# EAGLE design IsoBunny (EAGLE 9.2.1)
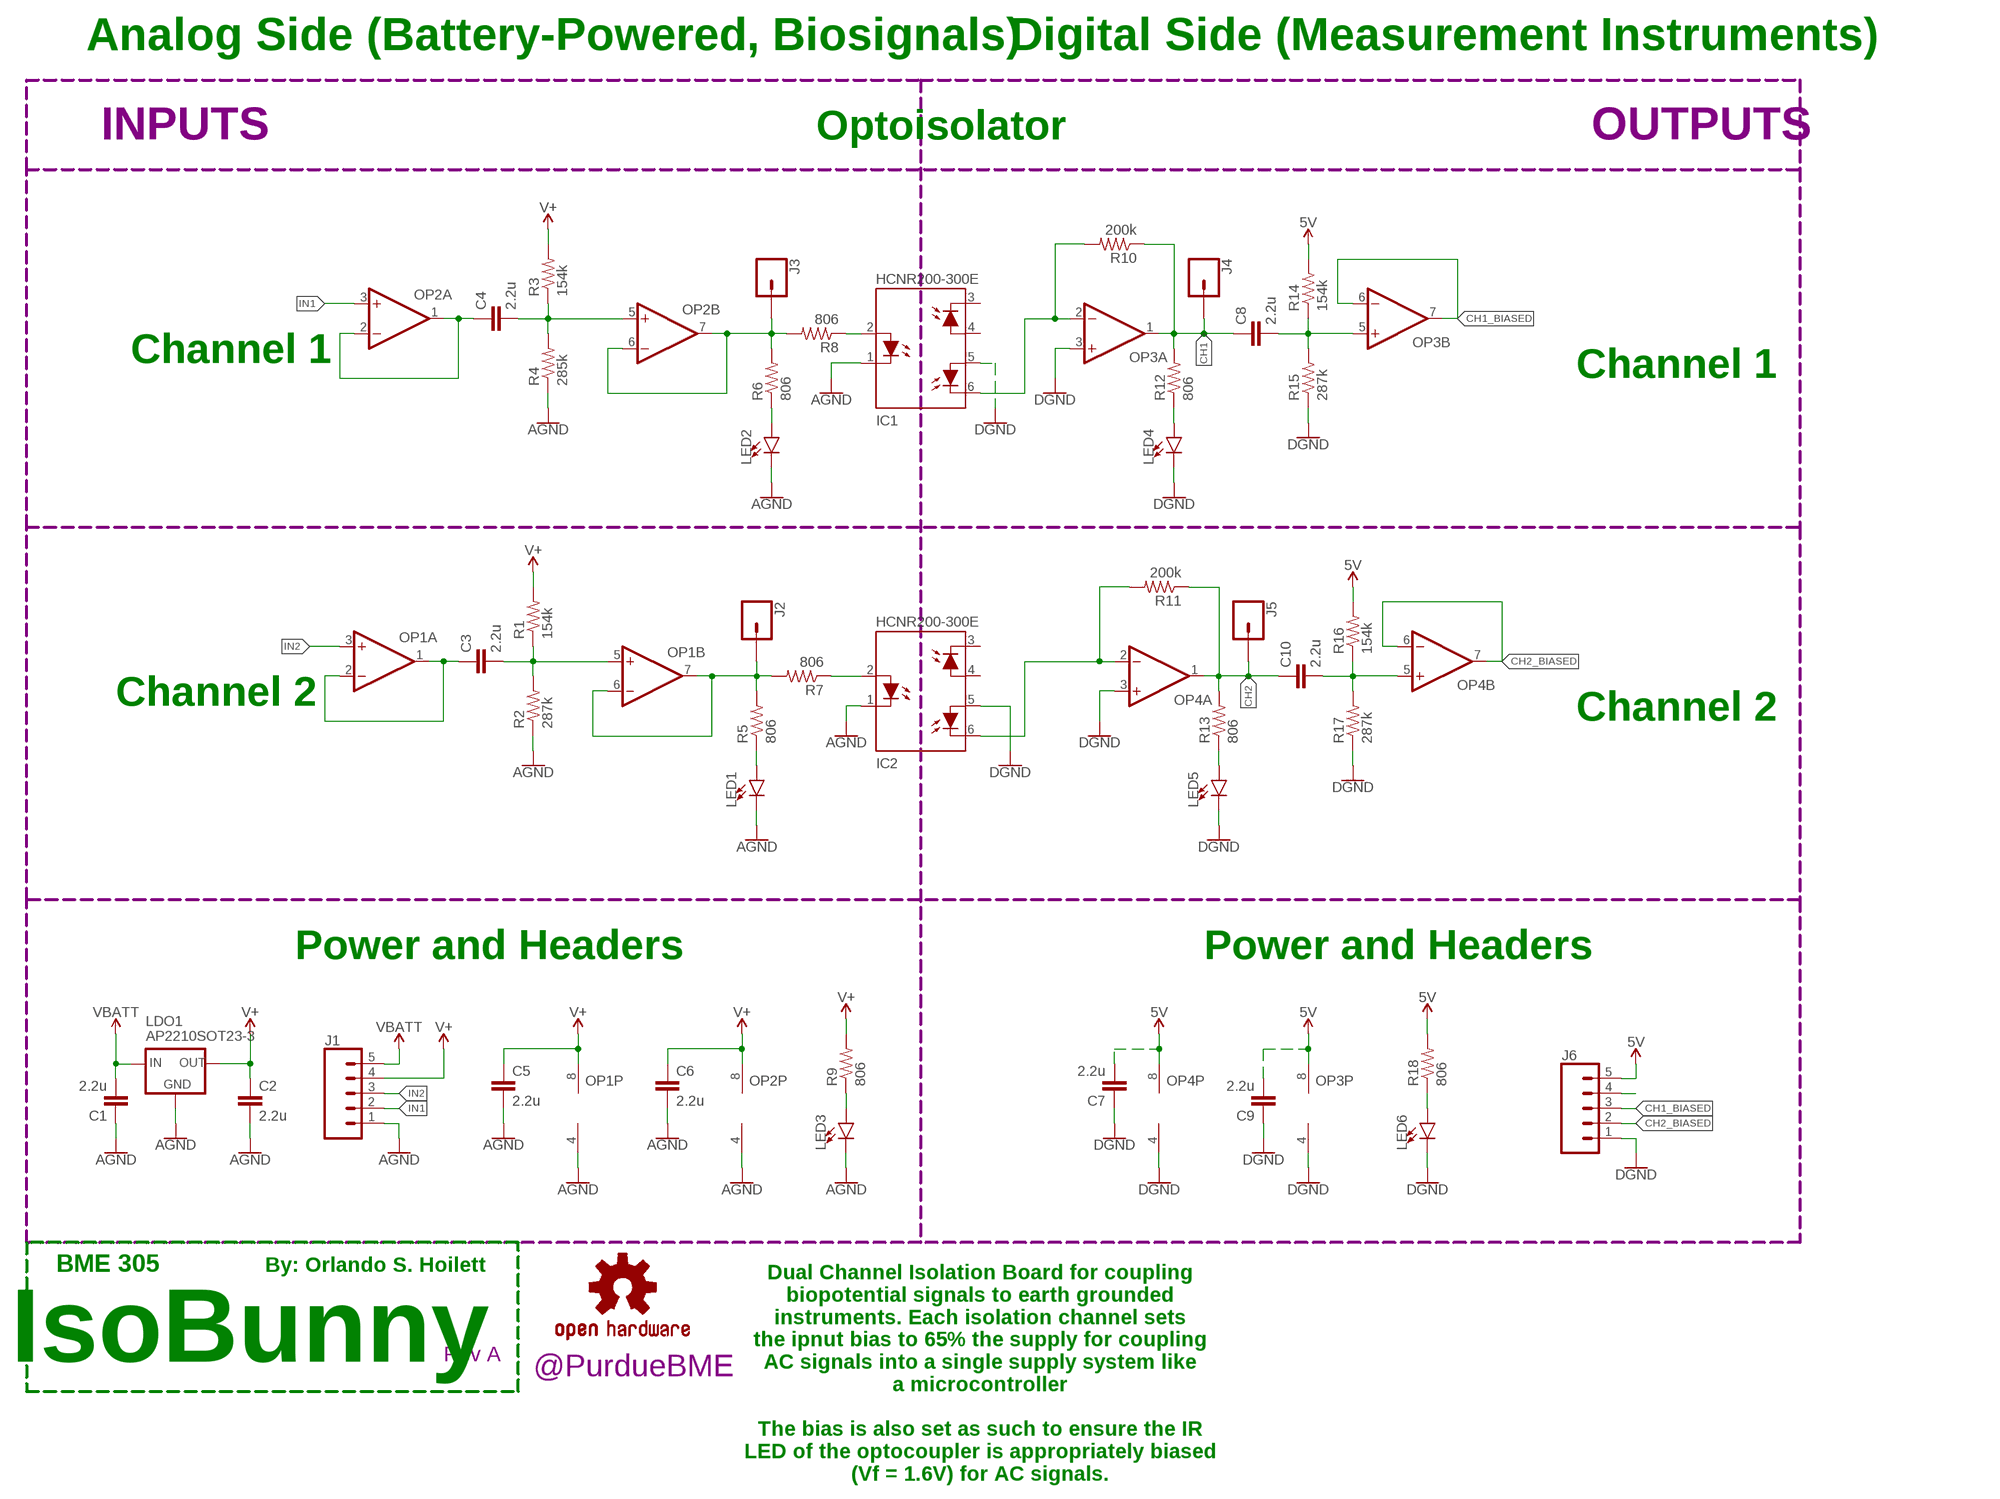
[diagram p0: schematic, sheet 1]

## Parts
C1  2.2u  CAPACITOR0603  [C0603]
C2  2.2u  CAPACITOR0603  [C0603]
C3  2.2u  CAPACITOR0603  [C0603]
C4  2.2u  CAPACITOR0603  [C0603]
C5  2.2u  CAPACITOR0603  [C0603]
C6  2.2u  CAPACITOR0603  [C0603]
C7  2.2u  CAPACITOR0603  [C0603]
C8  2.2u  CAPACITOR0603  [C0603]
C9  2.2u  CAPACITOR0603  [C0603]
C10  2.2u  CAPACITOR0603  [C0603]
IC1  HCNR200-300E  [DIP8-400]
IC2  HCNR200-300E  [DIP8-400]
J1  CONN_05  [1X05]
J2  CONN_01PTH_NO_SILK_KIT  [1X01NS_KIT]
J3  CONN_01PTH_NO_SILK_KIT  [1X01NS_KIT]
J4  CONN_01PTH_NO_SILK_KIT  [1X01NS_KIT]
J5  CONN_01PTH_NO_SILK_KIT  [1X01NS_KIT]
J6  CONN_05  [1X05]
LDO1  AP2210SOT23-3  [SOT23]
LED1  LED5MM  [LED_5MM]
LED2  LED5MM  [LED_5MM]
LED3  LED5MM  [LED_5MM]
LED4  LED5MM  [LED_5MM]
LED5  LED5MM  [LED_5MM]
LED6  LED5MM  [LED_5MM]
LOGO1  OSHW-LOGOL  [OSHW-LOGO-L]
OP1  OP-DUALR  [SO8]
OP2  OP-DUALR  [SO8]
OP3  OP-DUALR  [SO8]
OP4  OP-DUALR  [SO8]
R1  154k  RESISTOR0603  [R0603]
R2  287k  RESISTOR0603  [R0603]
R3  154k  RESISTOR0603  [R0603]
R4  285k  RESISTOR0603  [R0603]
R5  806  RESISTOR0603  [R0603]
R6  806  RESISTOR0603  [R0603]
R7  806  RESISTOR0603  [R0603]
R8  806  RESISTOR0603  [R0603]
R9  806  RESISTOR0603  [R0603]
R10  200k  RESISTOR0603  [R0603]
R11  200k  RESISTOR0603  [R0603]
R12  806  RESISTOR0603  [R0603]
R13  806  RESISTOR0603  [R0603]
R14  154k  RESISTOR0603  [R0603]
R15  287k  RESISTOR0603  [R0603]
R16  154k  RESISTOR0603  [R0603]
R17  287k  RESISTOR0603  [R0603]
R18  806  RESISTOR0603  [R0603]
REV1  REVISION.A  [REV.A]
U$1  PURDUE_BME_HANDLE  [PURDUE_BME_HANDLE.1]

## Nets
5V: C7.2 C9.2 J6.5 OP3.8(P:V+) OP4.8(P:V+) R14.2 R16.2 R18.2
AGND: C1.1 C2.2 C5.2 C6.2 IC1.1(C) IC2.1(C) J1.1 LDO1.1(GND) LED1.K(C) LED2.K(C) LED3.K(C) OP1.4(P:V-) OP2.4(P:V-) R2.1 R4.1
CH1: C8.1 J4.1 OP3.1(A:OUT) R10.1 R12.2
CH1_BIASED: J6.3 OP3.6(B:-IN) OP3.7(B:OUT)
CH2: C10.1 J5.1 OP4.1(A:OUT) R11.1 R13.2
CH2_BIASED: J6.2 OP4.6(B:-IN) OP4.7(B:OUT)
DGND: C7.1 C9.1 IC1.5(A2) IC2.5(A2) J6.1 LED4.K(C) LED5.K(C) LED6.K(C) OP3.3(A:+IN) OP3.4(P:V-) OP4.3(A:+IN) OP4.4(P:V-) R15.1 R17.1
IN1: J1.2 OP2.3(A:+IN)
IN2: J1.3 OP1.3(A:+IN)
N$1: C4.1 OP2.1(A:OUT) OP2.2(A:-IN)
N$2: LED3.A R9.1
N$3: C4.2 OP2.5(B:+IN) R3.1 R4.2
N$4: C3.1 OP1.1(A:OUT) OP1.2(A:-IN)
N$5: IC1.6(C2) OP3.2(A:-IN) R10.2
N$6: C3.2 OP1.5(B:+IN) R1.1 R2.2
N$7: IC2.6(C2) OP4.2(A:-IN) R11.2
N$9: LED6.A R18.1
N$10: IC2.2(A) R7.1
N$11: C10.2 OP4.5(B:+IN) R16.1 R17.2
N$13: LED2.A R6.1
N$14: IC1.2(A) R8.1
N$15: C8.2 OP3.5(B:+IN) R14.1 R15.2
N$16: LED4.A R12.1
N$17: LED1.A R5.1
N$18: J6.4
N$19: LED5.A R13.1
OUT1: J3.1 OP2.6(B:-IN) OP2.7(B:OUT) R6.2 R8.2
OUT2: J2.1 OP1.6(B:-IN) OP1.7(B:OUT) R5.2 R7.2
V+: C2.1 C5.1 C6.1 J1.4 LDO1.2(OUT) OP1.8(P:V+) OP2.8(P:V+) R1.2 R3.2 R9.2
V_BATT: C1.2 J1.5 LDO1.3(IN) ; supply symbol labelled VBATT
Unconnected: IC1.3(C1) IC1.4(A1) IC2.3(C1) IC2.4(A1)

## Notes on the sheet
- Analog Side (Battery-Powered, Biosignals) | Digital Side (Measurement Instruments)
- INPUTS | Optoisolator | OUTPUTS
- Channel 1
- Channel 1
- Channel 2
- Channel 2
- Power and Headers | Power and Headers
- BME 305 | By: Orlando S. Hoilett
- IsoBunny
- Dual Channel Isolation Board for coupling
  biopotential signals to earth grounded
  instruments. Each isolation channel sets
  the ipnut bias to 65% the supply for coupling
  AC signals into a single supply system like
  a microcontroller
  
  The bias is also set as such to ensure the IR
  LED of the optocoupler is appropriately biased
  (Vf = 1.6V) for AC signals.

## Library data of the parts
C1-C10 = CalvEngIO-Passives:CAPACITOR
IC1 IC2 = avago:HCNR20*: High-Linearity Analog Optocouplers Source: AV02-0886EN+DS+HCNR200+10Dec2011.pdf
J1 J6 = CalvEngIO-Connectors:CONN_05: Multi connection point. Often used as Generic Header-pin footprint for 0.1 inch spaced/style header connections On any of the 0.1 inch spaced packages, you can populate with these: Break Away Headers - Straight <https://www.sparkfun.com/products/116> (PRT-00116) Break Away Male Headers - Right Angle <https://www.sparkfun.com/products/553> (PRT-00553) Female Headers <https://www.sparkfun.com/products/115> (PRT-00115) Break Away Headers - Machine Pin <https://www.sparkfun.com/products/117> (PRT-00117) Break Away Female Headers - Swiss Machine Pin <https://www.sparkfun.com/products/743> (PRT-00743) For SCREWTERMINALS and SPRING TERMINALS visit here: Screw Terimnals on SparkFun.com <https://www.sparkfun.com/search/results?term=Screw+Terminals> (5mm/3.5mm/2.54mm spacing) This device is also useful as a general connection point to wire up your design to another part of your project. Our various solder wires solder well into these plated through hole pads. Hook-Up Wire - Assortment (Stranded, 22 AWG) <https://www.sparkfun.com/products/11375> (PRT-11375) Hook-Up Wire - Assortment (Solid Core, 22 AWG) <https://www.sparkfun.com/products/11367> (PRT-11367) View the entire wire category on our website here <https://www.sparkfun.com/categories/141> Special notes: Molex polarized connector foot print use with SKU : PRT-08231 with associated crimp pins and housings. 1MM SMD Version SKU: PRT-10208
J2-J5 = CalvEngIO-Connectors:CONN_01: Single connection point. Often used as Generic Header-pin footprint for 0.1 inch spaced/style header connections On any of the 0.1 inch spaced packages, you can populate with these: Break Away Headers - Straight <https://www.sparkfun.com/products/116> (PRT-00116) Break Away Male Headers - Right Angle <https://www.sparkfun.com/products/553> (PRT-00553) Female Headers <https://www.sparkfun.com/products/115> (PRT-00115) Break Away Headers - Machine Pin <https://www.sparkfun.com/products/117> (PRT-00117) Break Away Female Headers - Swiss Machine Pin <https://www.sparkfun.com/products/743> (PRT-00743) This device is also useful as a general connection point to wire up your design to another part of your project. Our various solder wires solder well into these plated through hole pads. Hook-Up Wire - Assortment (Stranded, 22 AWG) <https://www.sparkfun.com/products/11375> (PRT-11375) Hook-Up Wire - Assortment (Solid Core, 22 AWG) <https://www.sparkfun.com/products/11367> (PRT-11367) View the entire wire category on our website here <https://www.sparkfun.com/categories/141> Special notes: SMTSO-256-ET is a "flush mount" nut for a 4-40 screw. We mostly use this on specialty testbeds; it is a nice way to connect hardware to your PCB at an adjustable hieght. Also note, the SNAP packages are for using a snappable style connector. We sell a baggie of snaps and they are also used on two LilyPad designs: Snap Assortment - 30 pack (male and female) <https://www.sparkfun.com/products/11347> (DEV-11347) LilyPad Arduino SimpleSnap <https://www.sparkfun.com/products/10941> (DEV-10941) LilyPad SimpleSnap Protoboard <https://www.sparkfun.com/products/10940> (DEV-10940)
LDO1 = CalvEngIO-Power:AP2210
LED1-LED6 = CalvEngIO-LED:LED: LED (Generic) Standard schematic elements and footprints for 5mm, 3mm, 1206, and 0603 sized LEDs. Generic LEDs with no color specified. LTST-C190KGKT: arrow indicates cathode
LOGO1 = CalvEngIO-Logos:OSHW-LOGO: Open-Source Hardware (OSHW) Logo This logo indicates the piece of hardware it is found on incorporates a OSHW license and/or adheres to the definition of open source hardware found here: http://freedomdefined.org/OSHW
OP1-OP4 = CalvEngIO-AnalogIC:OP-DUAL: Precision Micropower, Low Noise CMOS, Rail-to-Rail Input/Output Operational Amplifiers Source: http://www.analog.com/static/imported-files/data_sheets/AD8603_8607_8609.pdf; MPN: AD8607ARMZ-R2; OC_FARNELL: 1651293; OC_NEWARK: 19M8927
R1-R18 = CalvEngIO-Passives:RESISTOR
REV1 = CalvEngIO-Symbols:REVISION.A
U$1 = CalvEngIO-Logos:PURDUE_BME_HANDLE

## Board
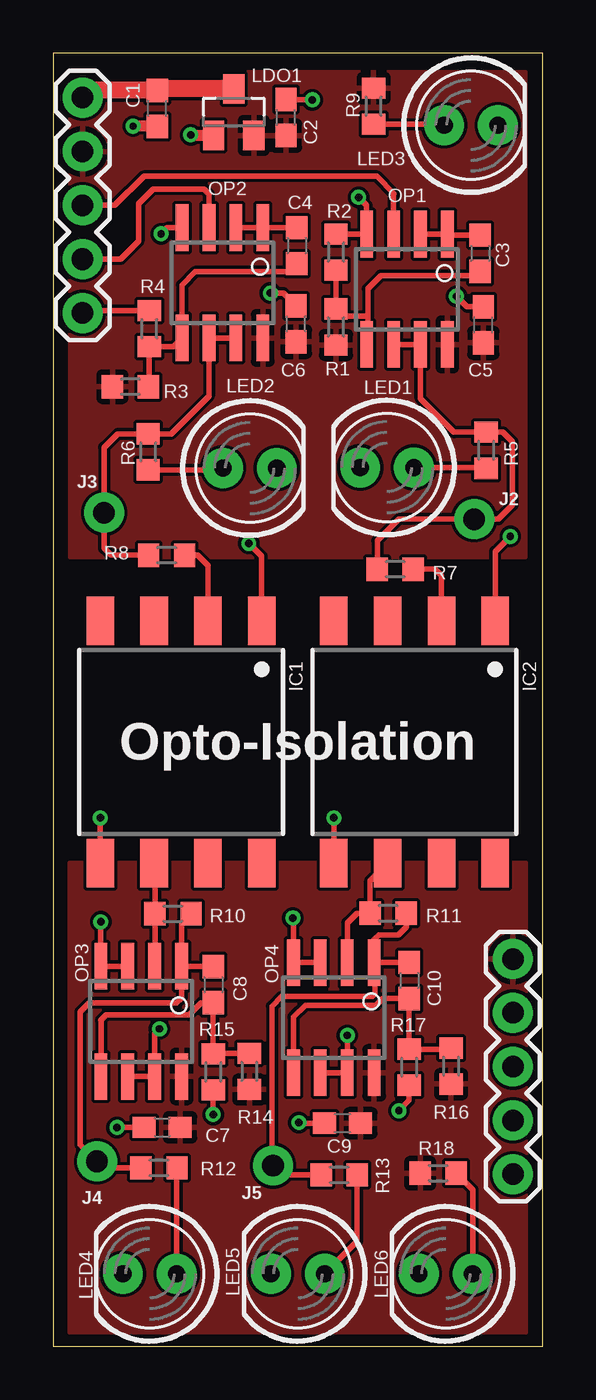
[diagram p1: board, top side]
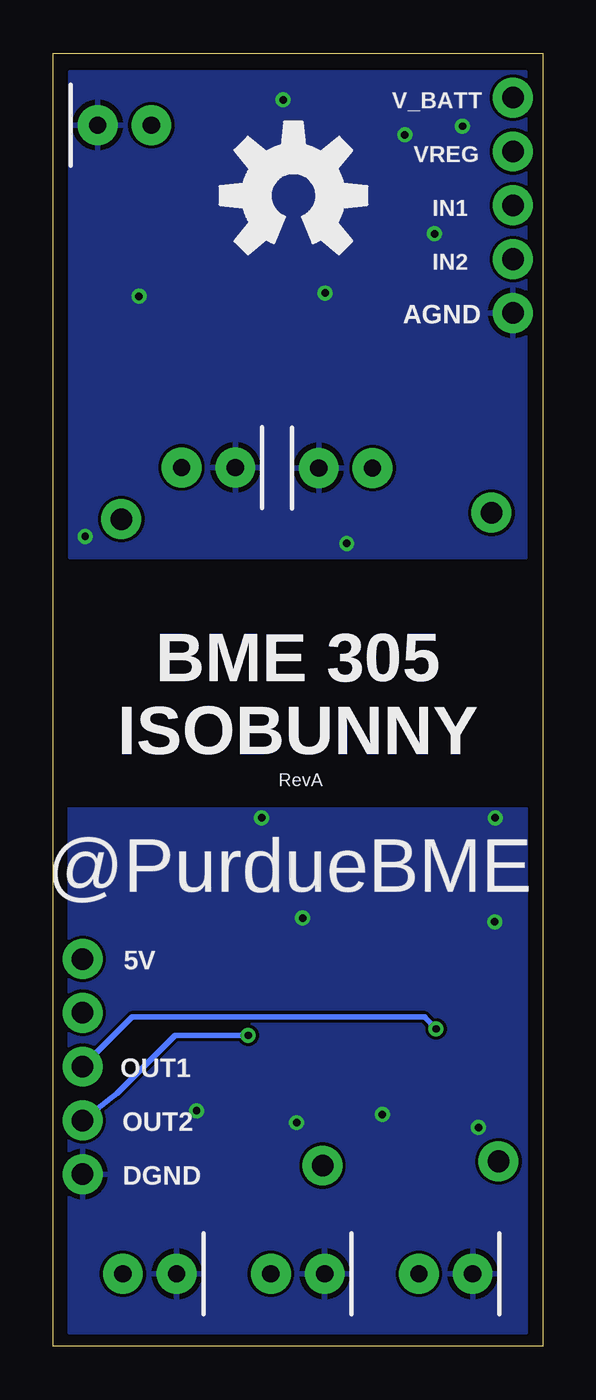
[diagram p2: board, bottom side, seen from below]

Size 23.11 x 61.04 mm. Coordinates in mm from the lower left corner, seen from the top.
Outline: 0,0 23.11,0 23.11,61.04 0,61.04 0,0
Copper layers (1*16): Top 0.0356mm / dielectric 1.5011mm / Bottom 0.0356mm
Design rules "LaenPCBOrder": minimum track width 6mil, minimum drill 13mil, track to track 6mil, track to pad 6mil, pad to pad 6mil, via to via 6mil, smd to smd 6mil, copper to edge 15mil, drill to drill 6mil, minimum pad ring 7mil, minimum via ring 7mil, stop-mask expansion 3mil, vias tented up to drill 0mil, thermal gap 10mil

### Footprints (pad centres in the part's own frame; a part is rotated, then mirrored left to right if it is on the bottom)
C0603 = smd 1.1 x 1: 1 -0.85,0; 2 0.85,0
DIP8-400 = smd 1.3 x 2.29: 1 -3.81,-5.72; 2 -1.27,-5.72; 3 1.27,-5.72; 4 3.81,-5.72; 5 3.81,5.72; 6 1.27,5.72; 7 -1.27,5.72; 8 -3.81,5.72
1X05 = drill 1.016 pad 1.88: 1 0,0; 2 2.54,0; 3 5.08,0; 4 7.62,0; 5 10.16,0
1X01NS_KIT = drill 1.016 pad 1.88: 1 0,0
SOT23 = smd 1 x 1.4: 1 -0.95,-1.1; 2 0.95,-1.1; 3 0,1.1
LED_5MM = drill 0.813 pad 1.88: A -1.27,0; K 1.27,0
SO8 = smd 0.6 x 2.2: 1 -1.905,-2.6; 2 -0.635,-2.6; 3 0.635,-2.6; 4 1.905,-2.6; 5 1.905,2.6; 6 0.635,2.6; 7 -0.635,2.6; 8 -1.905,2.6
R0603 = smd 1 x 1.1: 1 -0.85,0; 2 0.85,0

### Placement (x,y rotation side)
C1  4.93,58.42 90 top
C2  11,57.99 90 top
C3  20.17,51.59 270 top
C4  11.51,51.94 270 top
C5  20.32,48.21 90 top
C6  11.48,48.26 90 top
C7  5.16,10.34 0 top
C8  7.57,17.07 270 top
C9  13.67,10.54 0 top
C10  16.81,17.27 270 top
IC1  6.05,28.52 180 top
IC2  17.07,28.52 180 top
J1  1.4,48.77 90 top
J2  19.89,39.04 0 top
J3  2.41,39.34 0 top
J4  2.08,8.74 0 top
J5  10.39,8.53 0 top
J6  21.72,8.13 90 top
LDO1  8.53,58.24 0 top
LED1  15.77,41.48 180 top
LED2  9.3,41.45 0 top
LED3  19.74,57.63 0 top
LED4  4.57,3.43 180 top
LED5  11.56,3.43 180 top
LED6  18.54,3.43 180 top
LOGO1  11.76,54.31 0 bottom
OP1  16.71,49.89 180 top
OP2  8,50.19 180 top
OP3  4.17,15.34 180 top
OP4  13.26,15.52 180 top
R1  13.36,48.11 270 top
R2  13.36,51.64 270 top
R3  3.66,45.29 180 top
R4  4.55,48.03 270 top
R5  20.45,42.29 90 top
R6  4.5,42.21 90 top
R7  16.15,36.68 180 top
R8  5.36,37.34 180 top
R9  15.14,58.52 90 top
R10  5.66,20.42 180 top
R11  15.82,20.45 180 top
R12  5,8.43 180 top
R13  13.51,8.1 180 top
R14  9.27,12.98 270 top
R15  7.57,12.95 90 top
R16  18.8,13.23 270 top
R17  16.81,13.18 90 top
R18  18.19,8.18 180 top
REV1  12.47,26.42 0 bottom
U$1  11.94,23.98 180 bottom

### Tracks (layer width: path | path; a pad name or v marks a point on that pad's centre or on a via)
5V
  pour Top: 22.35,22.86 22.35,0.64 0.76,0.64 0.76,22.86
AGND  (via drill 0.35)
  Top 0.254: 5.93,52.79 OP2.4 5.39,52.79 v5.1,52.5 | C5.2 19.55,49.06 v19.05,49.55 | v14.43,54.23 14.81,53.85 OP1.4 R2.1 | IC2.1 20.88,37.51 v21.59,38.23 | IC1.1 9.86,37.29 v9.25,37.9 | C2.2 11.01,58.83 v12.24,58.83 | C6.2 10.88,49.71 v10.26,49.71 | R4.1 1.51,48.88 J1.1
  Top 0.508: LDO1.1 6.54,57.14 v6.5,57.17 | C1.1 v3.8,57.57 v3.79,57.58
  pour Bottom: 0.76,60.15 22.35,60.15 22.35,37.24 0.76,37.24
CH1
  Top 0.254: OP3.1 6.07,19.98 R10.1 | OP3.1 7.55,17.94 C8.1 | OP3.1 6.07,16.43 5.84,16.2 1.7,16.2 1.29,15.8 1.29,9.53 J4.1 2.39,8.43 R12.2
CH1_BIASED  (via drill 0.35)
  Top 0.254: OP3.6 OP3.7 4.8,14.76 v5.03,14.99
  Bottom 0.254: v5.03,14.99 5.56,15.52 5.56,15.54 19.38,15.54 J6.3
CH2
  Top 0.254: 15.21,18.12 OP4.1 15.16,19.2 15.39,19.43 16.31,19.43 16.67,19.8 R11.1 | 15.21,18.12 C10.1 | 15.21,18.12 15.19,18.09 15.19,16.61 15.09,16.51 10.79,16.51 10.34,16.05 10.34,8.59 J5.1 10.82,8.1 R13.2
CH2_BIASED  (via drill 0.35)
  Top 0.254: OP4.6 OP4.7 v13.89,14.68
  Bottom 0.254: v13.89,14.68 17.35,14.68 20.09,11.94 20.37,11.72 J6.2
DGND  (via drill 0.35)
  Top 0.254: v2.26,20.04 OP3.4 OP3.3 | OP4.3 OP4.4 11.35,20.19 v11.33,20.22 | 16.79,12.31 R17.1 16.81,11.61 v16.33,11.12 | R15.1 v7.57,10.95 | C9.1 11.63,10.54 v11.61,10.57 | IC1.5 v2.24,24.94 | IC2.5 v13.26,24.94 | C7.1 v3.02,10.34
  pour Bottom: 0.76,0.64 22.35,0.64 22.35,25.4 0.76,25.4
IN1
  Top 0.254: OP2.3 7.37,54.38 7.14,54.61 4.72,54.61 4.04,53.92 4.04,52.15 3.2,51.31 J1.2
IN2
  Top 0.254: OP1.3 16.08,54.38 16.1,54.41 15.29,55.22 4.29,55.22 2.92,53.85 J1.3
N$1
  Top 0.254: OP2.2 OP2.1 C4.1
N$2
  Top 0.254: R9.1 18.43,57.67 LED3.A
N$3
  Top 0.254: C4.2 11.51,51.07 11.15,50.71 6.72,50.71 6.1,50.09 OP2.5 5.69,47.18 R4.2 4.55,45.33 R3.1
N$4
  Top 0.254: OP1.2 OP1.1 18.67,52.44 C3.1
N$5
  Top 0.254: IC1.6 4.81,22.77 R10.2 4.81,17.95 OP3.2
N$6
  Top 0.254: C3.2 19.96,50.53 15.48,50.53 14.86,49.91 14.86,48.62 | 14.86,48.62 14.86,47.34 OP1.5 | R2.2 R1.1 13.7,48.62 14.86,48.62
N$7
  Top 0.254: IC2.6 14.97,21.98 R11.2 14.35,20.45 13.89,19.99 OP4.2
N$9
  Top 0.254: LED6.A 19.81,7.4 R18.1
N$10
  Top 0.254: IC2.2 18.34,36.37 18.03,36.68 R7.1
N$11
  Top 0.254: OP4.5 11.35,15.54 11.91,16.1 15.26,16.1 15.57,16.42 C10.2 R17.2 18.74,14.03 R16.1
N$13
  Top 0.254: LED2.A 7.94,41.37 R6.1
N$14
  Top 0.254: R8.1 6.83,37.34 7.31,36.85 IC1.2
N$15
  Top 0.254: OP3.5 2.27,12.73 2.27,15.38 2.26,15.39 2.51,15.65 6.43,15.65 7,16.22 C8.2 7.54,16.19 7.57,16.17 R15.2 7.59,13.83 R14.1
N$16
  Top 0.254: R12.1 5.84,8.42 LED4.A
N$17
  Top 0.254: R5.1 20.41,41.48 LED1.A
N$19
  Top 0.254: R13.1 14.36,4.96 LED5.A
OUT1
  Top 0.254: OP2.7 OP2.6 7.37,44.86 5.57,43.06 R6.2 3.06,43.06 2.41,42.42 J3.1 2.41,37.67 2.74,37.34 R8.2
OUT2
  Top 0.254: OP1.6 OP1.7 17.35,44.73 18.94,43.14 R5.2 21.25,43.14 21.69,42.7 21.69,39.7 21.03,39.04 J2.1 16.33,39.04 15.32,38.02 R7.2
V+
  pour Top: 0.76,37.24 22.35,37.24 22.35,60.15 0.76,60.15
V_BATT
  Top 0.813: LDO1.3 5,59.34 C1.2 1.74,59.27 J1.5

### Text on the board
tPlace: Opto-Isolation
bPlace: BME 305 / ISOBUNNY | 5V | OUT1 | OUT2 | DGND
bNames: V_BATT | VREG | IN1 | IN2 | AGND